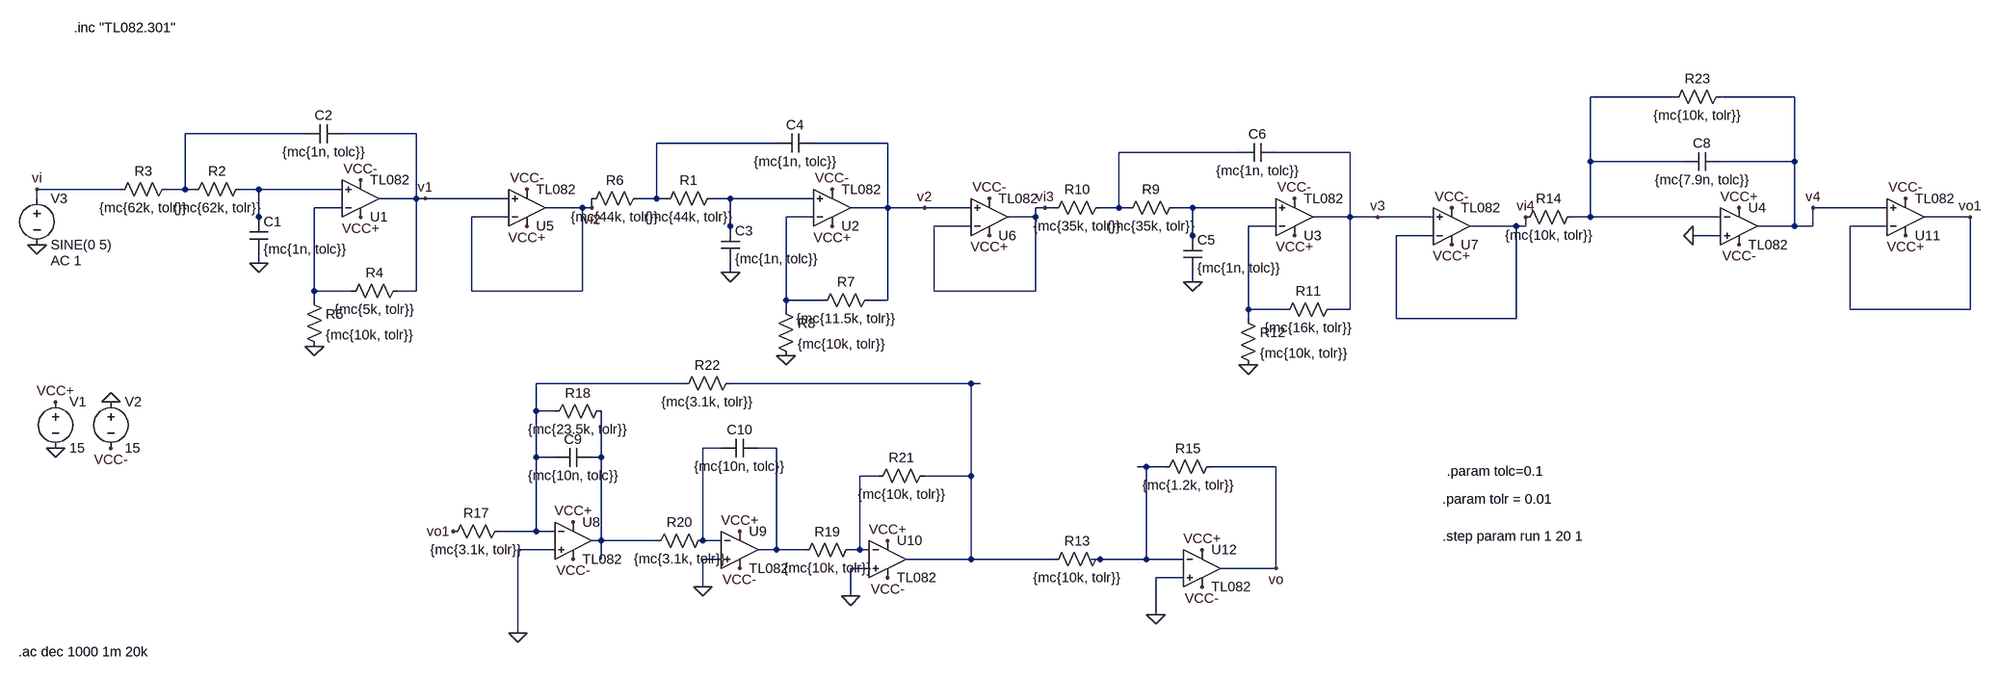
[diagram p0: schematic filtro montecarlo.asc]
filtro montecarlo.asc, the LTspice schematic file:
Version 4
SHEET 1 2548 1008
WIRE 2000 32 1808 32
WIRE 2208 32 2080 32
WIRE -416 96 -624 96
WIRE -224 96 -352 96
WIRE 400 112 192 112
WIRE 592 112 464 112
WIRE 1200 128 992 128
WIRE 1392 128 1264 128
WIRE 1808 144 1808 32
WIRE 2016 144 1808 144
WIRE 2208 144 2208 32
WIRE 2208 144 2080 144
WIRE -736 192 -880 192
WIRE -624 192 -624 96
WIRE -624 192 -656 192
WIRE -608 192 -624 192
WIRE -496 192 -528 192
WIRE -352 192 -496 192
WIRE -880 208 -880 192
WIRE -224 208 -224 96
WIRE -224 208 -288 208
WIRE -208 208 -224 208
WIRE -64 208 -208 208
WIRE 192 208 192 112
WIRE 192 208 160 208
WIRE 208 208 192 208
WIRE 320 208 288 208
WIRE 464 208 320 208
WIRE -352 224 -400 224
WIRE 64 224 0 224
WIRE 80 224 80 208
WIRE 80 224 64 224
WIRE 592 224 592 112
WIRE 592 224 528 224
WIRE 656 224 592 224
WIRE 736 224 656 224
WIRE 864 224 848 224
WIRE 880 224 864 224
WIRE 992 224 992 128
WIRE 992 224 960 224
WIRE 1008 224 992 224
WIRE 1120 224 1088 224
WIRE 1264 224 1120 224
WIRE 2368 224 2240 224
WIRE -496 240 -496 192
WIRE -64 240 -128 240
WIRE 464 240 416 240
WIRE 848 240 848 224
WIRE 848 240 800 240
WIRE 1392 240 1392 128
WIRE 1392 240 1328 240
WIRE 1440 240 1392 240
WIRE 1536 240 1440 240
WIRE 1808 240 1808 144
WIRE 1808 240 1776 240
WIRE 2080 240 1808 240
WIRE 2512 240 2432 240
WIRE -496 256 -496 240
WIRE 320 256 320 208
WIRE 736 256 672 256
WIRE 1264 256 1216 256
WIRE 1680 256 1600 256
WIRE 1696 256 1696 240
WIRE 1696 256 1680 256
WIRE 2208 256 2208 144
WIRE 2208 256 2144 256
WIRE 2240 256 2240 224
WIRE 2240 256 2208 256
WIRE 2368 256 2304 256
WIRE 320 272 320 256
WIRE 1120 272 1120 224
WIRE 1536 272 1472 272
WIRE 2080 272 2032 272
WIRE 1120 288 1120 272
WIRE -496 320 -496 304
WIRE 320 336 320 320
WIRE 1120 352 1120 336
WIRE -400 368 -400 224
WIRE -336 368 -400 368
WIRE -224 368 -224 208
WIRE -224 368 -256 368
WIRE -128 368 -128 240
WIRE 64 368 64 224
WIRE 64 368 -128 368
WIRE 672 368 672 256
WIRE 848 368 848 240
WIRE 848 368 672 368
WIRE -400 384 -400 368
WIRE 416 384 416 240
WIRE 480 384 416 384
WIRE 592 384 592 224
WIRE 592 384 560 384
WIRE 416 400 416 384
WIRE 1216 400 1216 256
WIRE 1280 400 1216 400
WIRE 1392 400 1392 240
WIRE 1392 400 1360 400
WIRE 2304 400 2304 256
WIRE 2512 400 2512 240
WIRE 2512 400 2304 400
WIRE 1216 416 1216 400
WIRE 1472 416 1472 272
WIRE 1680 416 1680 256
WIRE 1680 416 1472 416
WIRE 240 528 -16 528
WIRE 736 528 320 528
WIRE 752 528 736 528
WIRE -16 576 -16 528
WIRE 16 576 -16 576
WIRE 304 640 272 640
WIRE 400 640 368 640
WIRE -16 656 -16 576
WIRE 16 656 -16 656
WIRE 96 656 96 576
WIRE 96 656 80 656
WIRE 1040 672 1024 672
WIRE 1072 672 1040 672
WIRE 1264 672 1152 672
WIRE 576 688 544 688
WIRE 736 688 736 528
WIRE 736 688 656 688
WIRE -16 784 -16 656
WIRE -16 784 -80 784
WIRE 16 784 -16 784
WIRE 96 800 96 656
WIRE 96 800 80 800
WIRE 192 800 96 800
WIRE 272 800 272 640
WIRE 304 800 272 800
WIRE 16 816 -48 816
WIRE 400 816 400 640
WIRE 400 816 368 816
WIRE 448 816 400 816
WIRE 544 816 544 688
WIRE 544 816 528 816
WIRE 560 816 544 816
WIRE 96 832 96 800
WIRE 304 832 272 832
WIRE 736 832 736 688
WIRE 736 832 624 832
WIRE 880 832 736 832
WIRE 960 832 944 832
WIRE 1040 832 1040 672
WIRE 1040 832 960 832
WIRE 1104 832 1040 832
WIRE 560 848 528 848
WIRE 1264 848 1264 672
WIRE 1264 848 1168 848
WIRE 1104 864 1056 864
WIRE 272 880 272 832
WIRE 528 896 528 848
WIRE 1056 928 1056 864
WIRE -48 960 -48 816
FLAG -848 640 0
FLAG -752 560 0
FLAG -848 560 VCC+
FLAG -752 640 VCC-
FLAG -320 176 VCC-
FLAG -320 240 VCC+
FLAG -496 320 0
FLAG -400 464 0
FLAG 496 192 VCC-
FLAG 496 256 VCC+
FLAG 320 336 0
FLAG 416 480 0
FLAG 1296 208 VCC-
FLAG 1296 272 VCC+
FLAG 1120 352 0
FLAG 1216 496 0
FLAG 2112 288 VCC-
FLAG 2112 224 VCC+
FLAG -32 192 VCC-
FLAG -32 256 VCC+
FLAG 768 208 VCC-
FLAG 768 272 VCC+
FLAG 1568 224 VCC-
FLAG 1568 288 VCC+
FLAG 48 768 VCC+
FLAG 48 832 VCC-
FLAG 336 784 VCC+
FLAG 336 848 VCC-
FLAG 592 800 VCC+
FLAG 592 864 VCC-
FLAG -160 784 vo1
FLAG 2400 208 VCC-
FLAG 2400 272 VCC+
FLAG 2512 240 vo1
FLAG 528 896 0
FLAG 272 880 0
FLAG -880 288 0
FLAG -48 960 0
FLAG 1264 848 vo
FLAG -880 192 vi
FLAG -208 208 v1
FLAG 80 224 vi2
FLAG 656 224 v2
FLAG 864 224 vi3
FLAG 1440 240 v3
FLAG 1696 240 vi4
FLAG 2240 224 v4
FLAG 2032 272 0
FLAG 1136 816 VCC+
FLAG 1136 880 VCC-
FLAG 1056 928 0
SYMBOL Opamps\\opamp2 -320 272 M180
SYMATTR InstName U1
SYMATTR Value TL082
SYMBOL voltage -848 544 R0
WINDOW 123 0 0 Left 2
WINDOW 39 0 0 Left 2
SYMATTR InstName V1
SYMATTR Value 15
SYMBOL voltage -752 544 R0
WINDOW 123 0 0 Left 2
WINDOW 39 0 0 Left 2
SYMATTR InstName V2
SYMATTR Value 15
SYMBOL res -512 176 R90
WINDOW 0 0 56 VBottom 2
WINDOW 3 32 56 VTop 2
SYMATTR InstName R2
SYMATTR Value {mc{62k, tolr}}
SYMBOL res -640 176 R90
WINDOW 0 0 56 VBottom 2
WINDOW 3 32 56 VTop 2
SYMATTR InstName R3
SYMATTR Value {mc{62k, tolr}}
SYMBOL res -240 352 R90
WINDOW 0 0 56 VBottom 2
WINDOW 3 32 56 VTop 2
SYMATTR InstName R4
SYMATTR Value {mc{5k, tolr}}
SYMBOL res -416 368 R0
SYMATTR InstName R5
SYMATTR Value {mc{10k, tolr}}
SYMBOL cap -512 240 R0
SYMATTR InstName C1
SYMATTR Value {mc{1n, tolc}}
SYMBOL cap -352 80 R90
WINDOW 0 0 32 VBottom 2
WINDOW 3 32 32 VTop 2
SYMATTR InstName C2
SYMATTR Value {mc{1n, tolc}}
SYMBOL Opamps\\opamp2 496 288 M180
SYMATTR InstName U2
SYMATTR Value TL082
SYMBOL res 304 192 R90
WINDOW 0 0 56 VBottom 2
WINDOW 3 32 56 VTop 2
SYMATTR InstName R1
SYMATTR Value {mc{44k, tolr}}
SYMBOL res 176 192 R90
WINDOW 0 0 56 VBottom 2
WINDOW 3 32 56 VTop 2
SYMATTR InstName R6
SYMATTR Value {mc{44k, tolr}}
SYMBOL res 576 368 R90
WINDOW 0 0 56 VBottom 2
WINDOW 3 32 56 VTop 2
SYMATTR InstName R7
SYMATTR Value {mc{11.5k, tolr}}
SYMBOL res 400 384 R0
SYMATTR InstName R8
SYMATTR Value {mc{10k, tolr}}
SYMBOL cap 304 256 R0
SYMATTR InstName C3
SYMATTR Value {mc{1n, tolc}}
SYMBOL cap 464 96 R90
WINDOW 0 0 32 VBottom 2
WINDOW 3 32 32 VTop 2
SYMATTR InstName C4
SYMATTR Value {mc{1n, tolc}}
SYMBOL Opamps\\opamp2 1296 304 M180
SYMATTR InstName U3
SYMATTR Value TL082
SYMBOL res 1104 208 R90
WINDOW 0 0 56 VBottom 2
WINDOW 3 32 56 VTop 2
SYMATTR InstName R9
SYMATTR Value {mc{35k, tolr}}
SYMBOL res 976 208 R90
WINDOW 0 0 56 VBottom 2
WINDOW 3 32 56 VTop 2
SYMATTR InstName R10
SYMATTR Value {mc{35k, tolr}}
SYMBOL res 1376 384 R90
WINDOW 0 0 56 VBottom 2
WINDOW 3 32 56 VTop 2
SYMATTR InstName R11
SYMATTR Value {mc{16k, tolr}}
SYMBOL res 1200 400 R0
SYMATTR InstName R12
SYMATTR Value {mc{10k, tolr}}
SYMBOL cap 1104 272 R0
SYMATTR InstName C5
SYMATTR Value {mc{1n, tolc}}
SYMBOL cap 1264 112 R90
WINDOW 0 0 32 VBottom 2
WINDOW 3 32 32 VTop 2
SYMATTR InstName C6
SYMATTR Value {mc{1n, tolc}}
SYMBOL Opamps\\opamp2 2112 192 R0
SYMATTR InstName U4
SYMATTR Value TL082
SYMBOL res 1792 224 R90
WINDOW 0 0 56 VBottom 2
WINDOW 3 32 56 VTop 2
SYMATTR InstName R14
SYMATTR Value {mc{10k, tolr}}
SYMBOL cap 2080 128 R90
WINDOW 0 0 32 VBottom 2
WINDOW 3 32 32 VTop 2
SYMATTR InstName C8
SYMATTR Value {mc{7.9n, tolc}}
SYMBOL Opamps\\opamp2 -32 288 M180
SYMATTR InstName U5
SYMATTR Value TL082
SYMBOL Opamps\\opamp2 768 304 M180
SYMATTR InstName U6
SYMATTR Value TL082
SYMBOL Opamps\\opamp2 1568 320 M180
SYMATTR InstName U7
SYMATTR Value TL082
SYMBOL res -64 768 R90
WINDOW 0 0 56 VBottom 2
WINDOW 3 32 56 VTop 2
SYMATTR InstName R17
SYMATTR Value {mc{3.1k, tolr}}
SYMBOL res 112 560 R90
WINDOW 0 0 56 VBottom 2
WINDOW 3 32 56 VTop 2
SYMATTR InstName R18
SYMATTR Value {mc{23.5k, tolr}}
SYMBOL cap 80 640 R90
WINDOW 0 0 32 VBottom 2
WINDOW 3 32 32 VTop 2
SYMATTR InstName C9
SYMATTR Value {mc{10n, tolc}}
SYMBOL res 288 784 R90
WINDOW 0 0 56 VBottom 2
WINDOW 3 32 56 VTop 2
SYMATTR InstName R20
SYMATTR Value {mc{3.1k, tolr}}
SYMBOL Opamps\\opamp2 48 736 R0
SYMATTR InstName U8
SYMATTR Value TL082
SYMBOL Opamps\\opamp2 336 752 R0
SYMATTR InstName U9
SYMATTR Value TL082
SYMBOL Opamps\\opamp2 592 768 R0
SYMATTR InstName U10
SYMATTR Value TL082
SYMBOL cap 368 624 R90
WINDOW 0 0 32 VBottom 2
WINDOW 3 32 32 VTop 2
SYMATTR InstName C10
SYMATTR Value {mc{10n, tolc}}
SYMBOL res 544 800 R90
WINDOW 0 0 56 VBottom 2
WINDOW 3 32 56 VTop 2
SYMATTR InstName R19
SYMATTR Value {mc{10k, tolr}}
SYMBOL res 672 672 R90
WINDOW 0 0 56 VBottom 2
WINDOW 3 32 56 VTop 2
SYMATTR InstName R21
SYMATTR Value {mc{10k, tolr}}
SYMBOL res 336 512 R90
WINDOW 0 0 56 VBottom 2
WINDOW 3 32 56 VTop 2
SYMATTR InstName R22
SYMATTR Value {mc{3.1k, tolr}}
SYMBOL Opamps\\opamp2 2400 304 M180
SYMATTR InstName U11
SYMATTR Value TL082
SYMBOL voltage -880 192 R0
WINDOW 123 24 124 Left 2
WINDOW 39 0 0 Left 2
SYMATTR Value2 AC 1
SYMATTR InstName V3
SYMATTR Value SINE(0 5)
SYMBOL res 2096 16 R90
WINDOW 0 0 56 VBottom 2
WINDOW 3 32 56 VTop 2
SYMATTR InstName R23
SYMATTR Value {mc{10k, tolr}}
SYMBOL Opamps\\opamp2 1136 784 R0
SYMATTR InstName U12
SYMATTR Value TL082
SYMBOL res 976 816 R90
WINDOW 0 0 56 VBottom 2
WINDOW 3 32 56 VTop 2
SYMATTR InstName R13
SYMATTR Value {mc{10k, tolr}}
SYMBOL res 1168 656 R90
WINDOW 0 0 56 VBottom 2
WINDOW 3 32 56 VTop 2
SYMATTR InstName R15
SYMATTR Value {mc{1.2k, tolr}}
TEXT -816 -88 Left 2 !.inc "TL082.301"
TEXT 1552 792 Left 2 !.step param run 1 20 1
TEXT 1552 728 Left 2 !.param tolr = 0.01
TEXT 1560 680 Left 2 !.param tolc=0.1
TEXT -912 992 Left 2 !.ac dec 1000 1m 20k

The netlist it stands for:
* filtro montecarlo.asc
XU1 N005 N007 VCC+ VCC- v1 TL082  ; pins In+ In- V+ V- OUT
V1 VCC+ 0 15
V2 0 VCC- 15
R2 N005 N002 {mc{62k, tolr}}
R3 N002 vi {mc{62k, tolr}}
R4 v1 N007 {mc{5k, tolr}}
R5 N007 0 {mc{10k, tolr}}
C1 N005 0 {mc{1n, tolc}}
C2 v1 N002 {mc{1n, tolc}}
XU2 N006 N009 VCC+ VCC- v2 TL082  ; pins In+ In- V+ V- OUT
R1 N006 N003 {mc{44k, tolr}}
R6 N003 vi2 {mc{44k, tolr}}
R7 v2 N009 {mc{11.5k, tolr}}
R8 N009 0 {mc{10k, tolr}}
C3 N006 0 {mc{1n, tolc}}
C4 v2 N003 {mc{1n, tolc}}
XU3 N008 N010 VCC+ VCC- v3 TL082  ; pins In+ In- V+ V- OUT
R9 N008 N004 {mc{35k, tolr}}
R10 N004 vi3 {mc{35k, tolr}}
R11 v3 N010 {mc{16k, tolr}}
R12 N010 0 {mc{10k, tolr}}
C5 N008 0 {mc{1n, tolc}}
C6 v3 N004 {mc{1n, tolc}}
XU4 0 N001 VCC+ VCC- v4 TL082  ; pins In+ In- V+ V- OUT
R14 N001 vi4 {mc{10k, tolr}}
C8 v4 N001 {mc{7.9n, tolc}}
XU5 v1 vi2 VCC+ VCC- vi2 TL082  ; pins In+ In- V+ V- OUT
XU6 v2 vi3 VCC+ VCC- vi3 TL082  ; pins In+ In- V+ V- OUT
XU7 v3 vi4 VCC+ VCC- vi4 TL082  ; pins In+ In- V+ V- OUT
R17 N011 vo1 {mc{3.1k, tolr}}
R18 N015 N011 {mc{23.5k, tolr}}
C9 N015 N011 {mc{10n, tolc}}
R20 N013 N015 {mc{3.1k, tolr}}
XU8 0 N011 VCC+ VCC- N015 TL082  ; pins In+ In- V+ V- OUT
XU9 0 N013 VCC+ VCC- N014 TL082  ; pins In+ In- V+ V- OUT
XU10 0 N017 VCC+ VCC- N012 TL082  ; pins In+ In- V+ V- OUT
C10 N014 N013 {mc{10n, tolc}}
R19 N017 N014 {mc{10k, tolr}}
R21 N012 N017 {mc{10k, tolr}}
R22 N012 N011 {mc{3.1k, tolr}}
XU11 v4 vo1 VCC+ VCC- vo1 TL082  ; pins In+ In- V+ V- OUT
V3 vi 0 SINE(0 5) AC 1
R23 v4 N001 {mc{10k, tolr}}
XU12 0 N016 VCC+ VCC- vo TL082  ; pins In+ In- V+ V- OUT
R13 N016 N012 {mc{10k, tolr}}
R15 vo N016 {mc{1.2k, tolr}}
.inc "TL082.301"
.step param run 1 20 1
.param tolr = 0.01
.param tolc=0.1
.ac dec 1000 1m 20k
.backanno
.end